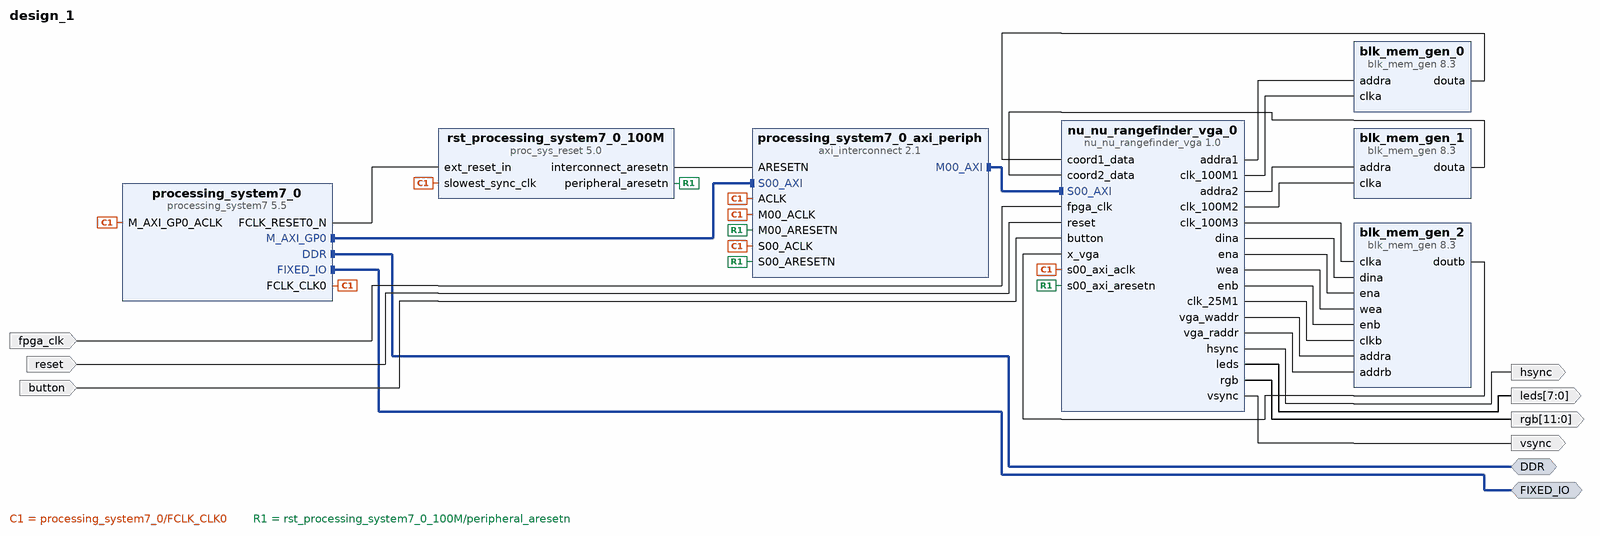
[diagram p0: block diagram of the top level]
# Vivado block design design_1, Vivado 2016.2
create_bd_design design_1

create_bd_intf_port -mode Master -vlnv xilinx.com:interface:ddrx_rtl:1.0 DDR
create_bd_intf_port -mode Master -vlnv xilinx.com:display_processing_system7:fixedio_rtl:1.0 FIXED_IO
create_bd_port -dir O hsync
create_bd_port -dir O vsync
create_bd_port -dir I fpga_clk
create_bd_port -dir I reset
create_bd_port -dir O -from 11 -to 0 rgb
create_bd_port -dir I button
create_bd_port -dir O -from 7 -to 0 leds

create_bd_cell -type ip -vlnv xilinx.com:ip:processing_system7:5.5 processing_system7_0
set_property -dict [list \
  CONFIG.PCW_UART1_BAUD_RATE 19200 \
  CONFIG.PCW_QSPI_GRP_SINGLE_SS_ENABLE 1 \
  CONFIG.PCW_ENET0_PERIPHERAL_ENABLE 0 \
  CONFIG.PCW_SD0_PERIPHERAL_ENABLE 0 \
  CONFIG.PCW_UART1_PERIPHERAL_ENABLE 1 \
  CONFIG.PCW_UART1_UART1_IO {MIO 48 .. 49} \
  CONFIG.PCW_USB0_PERIPHERAL_ENABLE 0 \
  CONFIG.preset ZedBoard \
] [get_bd_cells processing_system7_0]
# 1 more settings of processing_system7_0 are not shown: defaults, MIO pin electricals, DDR timing, and values the tool derives
create_bd_cell -type ip -vlnv xilinx.com:ip:axi_interconnect:2.1 processing_system7_0_axi_periph
set_property -dict {CONFIG.NUM_MI 1} [get_bd_cells processing_system7_0_axi_periph]
create_bd_cell -type ip -vlnv xilinx.com:ip:proc_sys_reset:5.0 rst_processing_system7_0_100M
create_bd_cell -type ip -vlnv xilinx.com:ip:blk_mem_gen:8.3 blk_mem_gen_0
set_property -dict [list \
  CONFIG.Memory_Type Single_Port_ROM \
  CONFIG.Enable_32bit_Address false \
  CONFIG.Write_Width_A 13 \
  CONFIG.Write_Depth_A 129 \
  CONFIG.Enable_A Always_Enabled \
  CONFIG.Register_PortA_Output_of_Memory_Primitives true \
  CONFIG.Load_Init_File true \
  CONFIG.Coe_File ../../../../../../../../../../Desktop/MQP/backups/coord1.coe \
  CONFIG.Use_RSTA_Pin false \
  CONFIG.Port_A_Write_Rate 0 \
  CONFIG.use_bram_block Stand_Alone \
] [get_bd_cells blk_mem_gen_0]
create_bd_cell -type ip -vlnv xilinx.com:ip:blk_mem_gen:8.3 blk_mem_gen_1
set_property -dict [list \
  CONFIG.Memory_Type Single_Port_ROM \
  CONFIG.Enable_32bit_Address false \
  CONFIG.Write_Width_A 13 \
  CONFIG.Write_Depth_A 129 \
  CONFIG.Enable_A Always_Enabled \
  CONFIG.Register_PortA_Output_of_Memory_Primitives true \
  CONFIG.Load_Init_File true \
  CONFIG.Coe_File ../../../../../../../../../../Desktop/MQP/backups/coord2.coe \
  CONFIG.Use_RSTA_Pin false \
  CONFIG.Port_A_Write_Rate 0 \
  CONFIG.use_bram_block Stand_Alone \
] [get_bd_cells blk_mem_gen_1]
create_bd_cell -type ip -vlnv xilinx.com:ip:blk_mem_gen:8.3 blk_mem_gen_2
set_property -dict [list \
  CONFIG.Memory_Type True_Dual_Port_RAM \
  CONFIG.Enable_32bit_Address false \
  CONFIG.Use_Byte_Write_Enable false \
  CONFIG.Write_Width_A 8 \
  CONFIG.Write_Depth_A 307200 \
  CONFIG.Read_Width_A 8 \
  CONFIG.Write_Width_B 8 \
  CONFIG.Read_Width_B 8 \
  CONFIG.Enable_B Use_ENB_Pin \
  CONFIG.Register_PortA_Output_of_Memory_Primitives true \
  CONFIG.Register_PortB_Output_of_Memory_Primitives true \
  CONFIG.Load_Init_File false \
  CONFIG.Fill_Remaining_Memory_Locations false \
  CONFIG.Use_RSTA_Pin false \
  CONFIG.Port_B_Clock 100 \
  CONFIG.Port_B_Write_Rate 50 \
  CONFIG.Port_B_Enable_Rate 100 \
  CONFIG.use_bram_block Stand_Alone \
] [get_bd_cells blk_mem_gen_2]
create_bd_cell -type ip -vlnv xilinx.com:user:nu_nu_rangefinder_vga:1.0 nu_nu_rangefinder_vga_0

# ---- connections ----

connect_bd_intf_net [get_bd_intf_pins processing_system7_0/M_AXI_GP0] [get_bd_intf_pins processing_system7_0_axi_periph/S00_AXI]
connect_bd_intf_net [get_bd_intf_pins processing_system7_0_axi_periph/M00_AXI] [get_bd_intf_pins nu_nu_rangefinder_vga_0/S00_AXI]
connect_bd_intf_net [get_bd_intf_ports DDR] [get_bd_intf_pins processing_system7_0/DDR]
connect_bd_intf_net [get_bd_intf_ports FIXED_IO] [get_bd_intf_pins processing_system7_0/FIXED_IO]
connect_bd_net [get_bd_pins processing_system7_0/FCLK_CLK0] \
  [get_bd_pins processing_system7_0/M_AXI_GP0_ACLK] [get_bd_pins rst_processing_system7_0_100M/slowest_sync_clk] \
  [get_bd_pins processing_system7_0_axi_periph/S00_ACLK] [get_bd_pins processing_system7_0_axi_periph/ACLK] \
  [get_bd_pins processing_system7_0_axi_periph/M00_ACLK] [get_bd_pins nu_nu_rangefinder_vga_0/s00_axi_aclk]
connect_bd_net [get_bd_pins processing_system7_0/FCLK_RESET0_N] [get_bd_pins rst_processing_system7_0_100M/ext_reset_in]
connect_bd_net [get_bd_pins rst_processing_system7_0_100M/peripheral_aresetn] \
  [get_bd_pins processing_system7_0_axi_periph/S00_ARESETN] [get_bd_pins processing_system7_0_axi_periph/M00_ARESETN] \
  [get_bd_pins nu_nu_rangefinder_vga_0/s00_axi_aresetn]
connect_bd_net [get_bd_pins rst_processing_system7_0_100M/interconnect_aresetn] [get_bd_pins processing_system7_0_axi_periph/ARESETN]
connect_bd_net [get_bd_pins nu_nu_rangefinder_vga_0/hsync] [get_bd_ports hsync]
connect_bd_net [get_bd_pins nu_nu_rangefinder_vga_0/vsync] [get_bd_ports vsync]
connect_bd_net [get_bd_ports fpga_clk] [get_bd_pins nu_nu_rangefinder_vga_0/fpga_clk]
connect_bd_net [get_bd_ports reset] [get_bd_pins nu_nu_rangefinder_vga_0/reset]
connect_bd_net [get_bd_pins nu_nu_rangefinder_vga_0/addra1] [get_bd_pins blk_mem_gen_0/addra]
connect_bd_net [get_bd_pins blk_mem_gen_0/douta] [get_bd_pins nu_nu_rangefinder_vga_0/coord1_data]
connect_bd_net [get_bd_pins nu_nu_rangefinder_vga_0/addra2] [get_bd_pins blk_mem_gen_1/addra]
connect_bd_net [get_bd_pins nu_nu_rangefinder_vga_0/clk_100M2] [get_bd_pins blk_mem_gen_1/clka]
connect_bd_net [get_bd_pins blk_mem_gen_1/douta] [get_bd_pins nu_nu_rangefinder_vga_0/coord2_data]
connect_bd_net [get_bd_pins nu_nu_rangefinder_vga_0/clk_100M3] [get_bd_pins blk_mem_gen_2/clka]
connect_bd_net [get_bd_pins nu_nu_rangefinder_vga_0/dina] [get_bd_pins blk_mem_gen_2/dina]
connect_bd_net [get_bd_pins nu_nu_rangefinder_vga_0/ena] [get_bd_pins blk_mem_gen_2/ena]
connect_bd_net [get_bd_pins nu_nu_rangefinder_vga_0/wea] [get_bd_pins blk_mem_gen_2/wea]
connect_bd_net [get_bd_pins blk_mem_gen_2/doutb] [get_bd_pins nu_nu_rangefinder_vga_0/x_vga]
connect_bd_net [get_bd_pins nu_nu_rangefinder_vga_0/enb] [get_bd_pins blk_mem_gen_2/enb]
connect_bd_net [get_bd_pins nu_nu_rangefinder_vga_0/clk_25M1] [get_bd_pins blk_mem_gen_2/clkb]
connect_bd_net [get_bd_pins nu_nu_rangefinder_vga_0/clk_100M1] [get_bd_pins blk_mem_gen_0/clka]
connect_bd_net [get_bd_pins nu_nu_rangefinder_vga_0/rgb] [get_bd_ports rgb]
connect_bd_net [get_bd_ports button] [get_bd_pins nu_nu_rangefinder_vga_0/button]
connect_bd_net [get_bd_pins nu_nu_rangefinder_vga_0/leds] [get_bd_ports leds]
connect_bd_net [get_bd_pins nu_nu_rangefinder_vga_0/vga_waddr] [get_bd_pins blk_mem_gen_2/addra]
connect_bd_net [get_bd_pins nu_nu_rangefinder_vga_0/vga_raddr] [get_bd_pins blk_mem_gen_2/addrb]

# ---- address map ----
assign_bd_address -offset 0x43C00000 -range 64K -target_address_space [get_bd_addr_spaces processing_system7_0/Data] [get_bd_addr_segs nu_nu_rangefinder_vga_0/S00_AXI/S00_AXI_reg]

validate_bd_design
save_bd_design
